# EasyEDA Pro project Complete_project.epro, board PCB2
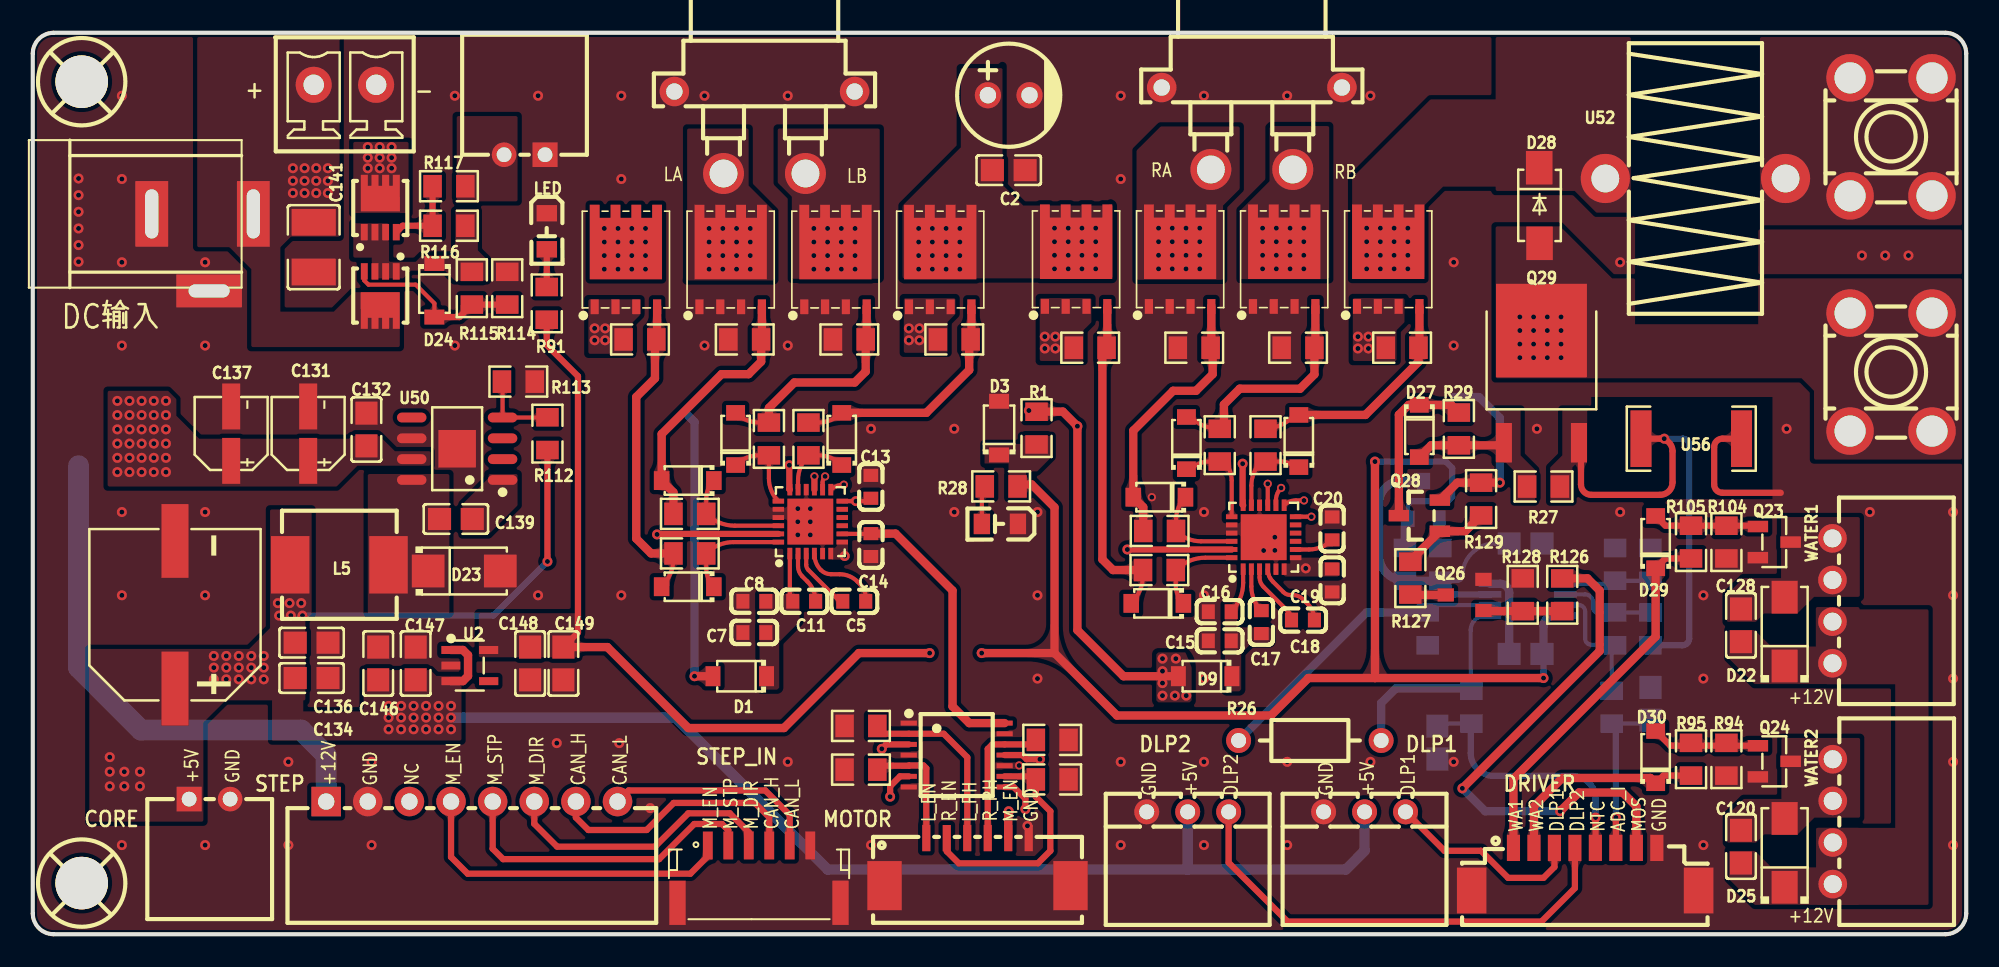
[diagram p14: board, top side]
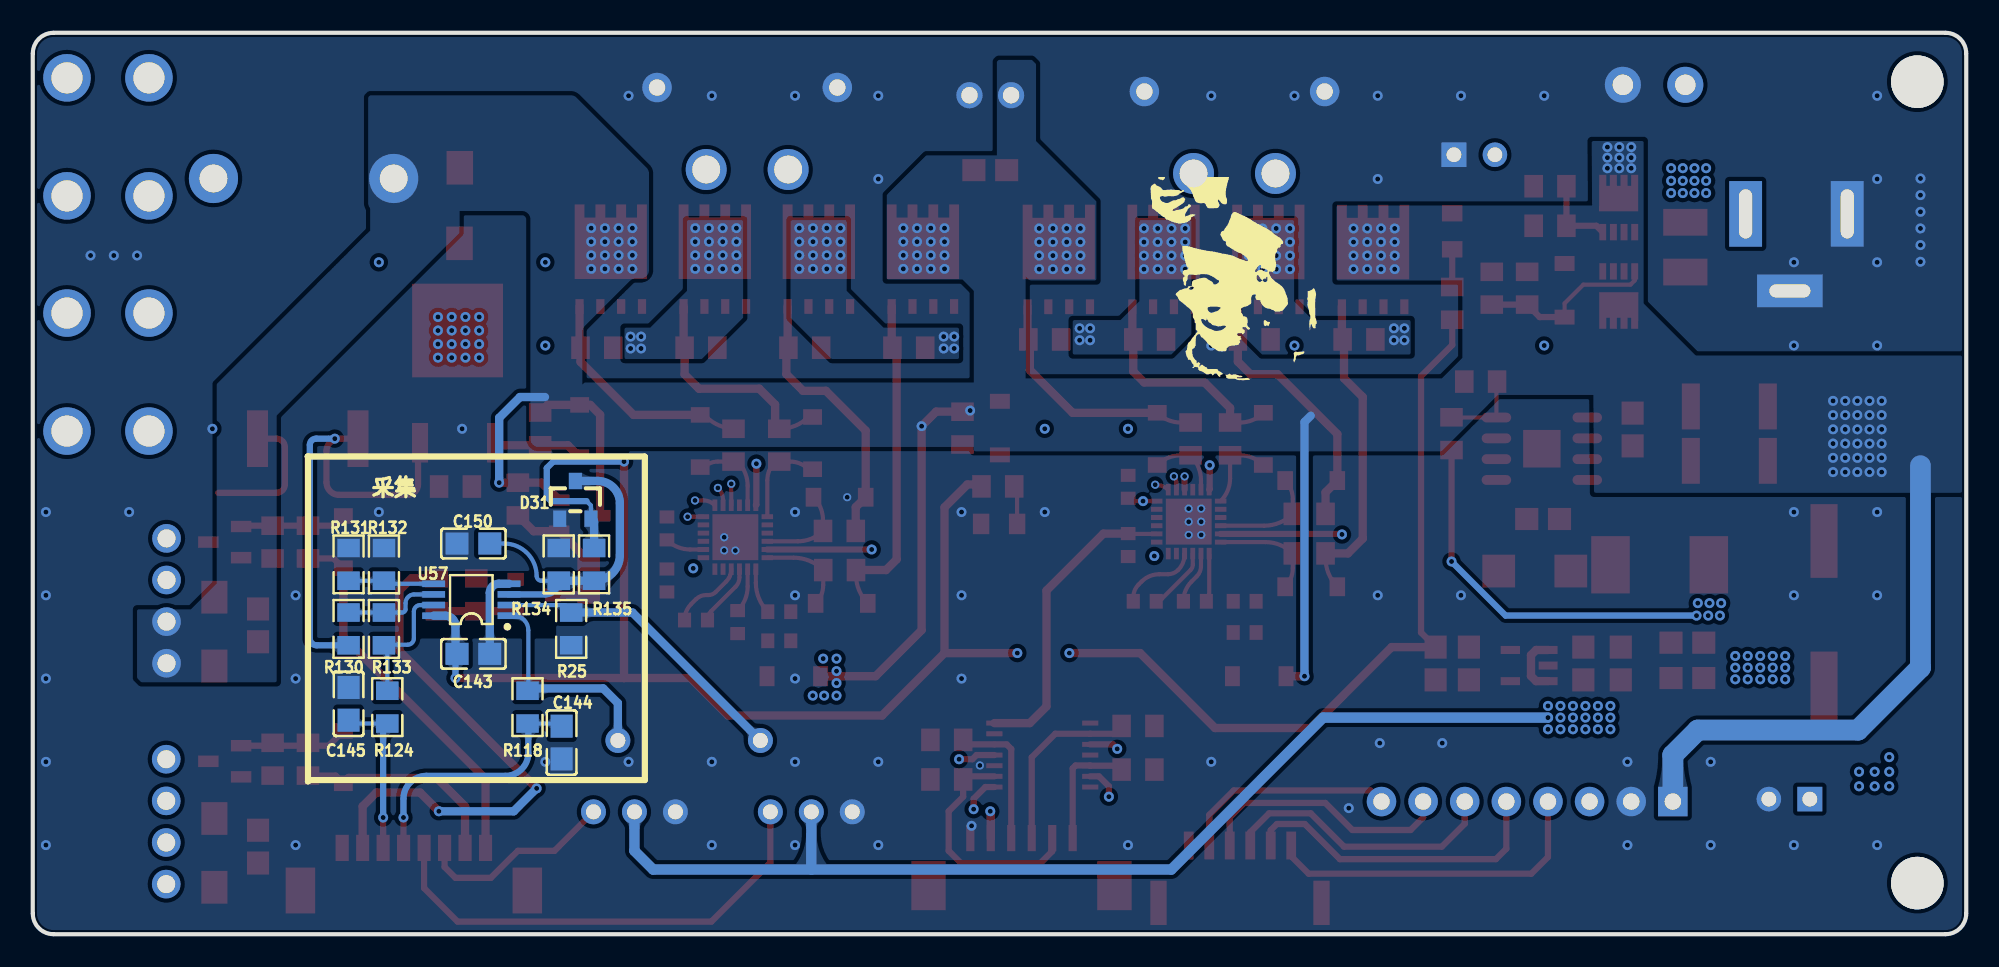
[diagram p15: board, bottom side, seen from below]

Outline 118 x 55 mm; copper layers: Top Layer, 信号层, GND, Bottom Layer. Coordinates in mm from the lower left corner of the outline.
Outline path: 0,53.73 0,1.27 arc(0.37,0.37) 1.27,0 116.73,0 arc(117.63,0.37) 118,1.27 118,53.73 arc(117.63,54.63) 116.73,55 1.27,55 arc(0.37,54.63) 0,53.73
Stack: Top Layer 0.035mm 外层铜厚1oz / Dielectric1 0.2104mm 7628 RC49% 8.6mil / 信号层 0.035mm / Dielectric2 1.065mm 1.1mm H/HOZ Copper / GND 0.035mm / Dielectric3 0.2104mm 7628 RC49% 8.6mil / Bottom Layer 0.035mm 外层铜厚1oz

## Design rules (mm)
template: 自定义配置
spacing copperThickness1oz (default): track to track 0.102, other pairs 0.152 to 0.3
spacing copperThickness2oz: track to track 0.203, other pairs 0.152 to 0.3
track width copperThickness1oz (default): min 0.127, default 0.254, max 2.54
track width copperThickness2oz: min 0.203, default 0.254, max 2.54
differential pair differentialPair (default): width min 0.127, default 0.254, max 2.54; gap min 0.152, default 0.152
via viaSize (default): diameter min 0.5, default 0.61, max 10; hole min 0.3, default 0.305, max 6.3

## Placement (name value [footprint] x y rotation side)
C1  220uF  [CAP-TH_BD6.3-P2.50-D1.0-FD]  59.56 51.19 0 top
C2  100nF  [C0805]  59.56 46.62 180 top
C5  100nF  [C0603]  50.13 20.31 180 top
C7  10uF  [C0603]  44.04 18.41 0 top
C8  100nF  [C0603]  44.04 20.31 0 top
C11  1uF  [C0603]  47.08 20.31 180 top
C13  1uF  [C0603]  51.15 27.3 90 top
C14  1uF  [C0603]  51.15 23.74 270 top
C15  10uF  [C0603]  72.44 17.9 0 top
C16  100nF  [C0603]  72.44 19.68 0 top
C17  1uF  [C0603]  74.98 19.04 270 top
C18  100nF  [C0603]  77.52 19.17 180 top
C19  1uF  [C0603]  79.3 21.58 270 top
C20  1uF  [C0603]  79.3 24.76 90 top
C120  100nF  [C0805]  104.25 5.34 270 top
C128  100nF  [C0805]  104.25 18.85 270 top
C131  4.7uF  [CAP-SMD_BD4.0-L4.3-W4.3-LS5.0-FD]  16.81 30.54 90 top
C132  100nF  [C0805]  20.36 30.8 270 top
C134  100nF  [C0805]  17.02 15.63 180 top
C135  470uF  [CAP-SMD_BD10.0-L10.3-W10.3-LS11.3-FD]  8.68 19.49 90 top
C136  100nF  [C0805]  17.02 17.79 180 top
C137  4.7uF  [CAP-SMD_BD4.0-L4.3-W4.3-LS5.0-FD]  12.11 30.54 90 top
C139  100nF  [C0805]  25.82 25.33 180 top
C141  100nF  [C1210]  17.14 41.92 270 top
C143  100nF  [C0805]  91.11 17.11 0 bottom
C144  10nF  [C0805]  85.72 11.69 90 bottom
C145  10nF  [C0805]  98.73 14.06 270 bottom
C146  100nF  [C0805]  21.08 16.52 270 top
C147  100nF  [C0805]  23.37 16.52 270 top
C148  100nF  [C0805]  30.35 16.52 90 top
C149  100nF  [C0805]  32.39 16.52 90 top
C150  100nF  [C0805]  91.11 23.84 0 bottom
CN16  ZX-XH2.54-2PWZ  [CONN-TH_2P-P2.50_ZX-XH2.54-2PWZ]  30.01 47.56 180 top
CN111  WJ15EDGVC-3.81-2P  [CONN-TH_WJ15EDGVC-3.81-2P]  19.05 51.82 0 top
CORE  -  [CONN-TH_2P-P2.50_ZX-XH2.54-2PWZ]  10.8 8.24 0 top
D1  1N5819W_C963381  [SOD-123_L2.7-W1.6-LS3.7-RD]  43.15 15.74 180 top
D2  1N4148W-E  [SOD-123_L2.8-W1.6-LS3.7-RD]  39.97 21.2 180 top
D3  BZT52C3V3  [SOD-123_L2.7-W1.6-LS3.7-RD]  58.97 30.88 90 top
D5  1N4148W-E  [SOD-123_L2.8-W1.6-LS3.7-RD]  39.97 27.68 180 top
D6  1N4148W-E  [SOD-123_L2.8-W1.6-LS3.7-RD]  49.37 30.22 90 top
D7  1N4148W-E  [SOD-123_L2.8-W1.6-LS3.7-RD]  42.9 30.22 90 top
D8  1N4148W-E  [SOD-123_L2.8-W1.6-LS3.7-RD]  68.63 20.19 180 top
D9  1N5819W_C963381  [SOD-123_L2.7-W1.6-LS3.7-RD]  71.55 15.74 180 top
D10  1N4148W-E  [SOD-123_L2.8-W1.6-LS3.7-RD]  68.76 26.66 180 top
D11  1N4148W-E  [SOD-123_L2.8-W1.6-LS3.7-RD]  77.27 30.09 90 top
D12  1N4148W-E  [SOD-123_L2.8-W1.6-LS3.7-RD]  70.41 29.97 90 top
D22  SS34  [SMA_L4.3-W2.5-LS5.0-RD]  106.92 18.46 90 top
D23  SS56  [SMA_L4.3-W2.6-LS5.2-RD]  26.33 22.16 0 top
D24  BZT52C27  [SOD-123_L2.7-W1.6-LS3.7-RD]  24.51 39.29 270 top
D25  SS34  [SMA_L4.3-W2.5-LS5.0-RD]  106.92 4.96 90 top
D27  1N4148W-E  [SOD-123_L2.8-W1.6-LS3.7-RD]  84.62 30.7 270 top
D28  SS54  [SMA_L4.3-W2.6-LS5.0-FD]  91.95 44.46 90 top
D29  1N4148W-E  [SOD-123_L2.8-W1.6-LS3.7-RD]  99.04 23.93 90 top
D30  1N4148W-E  [SOD-123_L2.8-W1.6-LS3.7-RD]  99.04 10.8 90 top
D31  BAV99  [SOT-23_L2.9-W1.3-P1.90-LS2.4-BR]  84.88 26.5 270 bottom
DLP1  HC-5264-3AW  [CONN-TH_3P-P2.50_HCTL_HC-5264-3AW]  81.28 7.47 180 top
DLP2  HC-5264-3AW  [CONN-TH_3P-P2.50_HCTL_HC-5264-3AW]  70.49 7.47 180 top
DRIVER  1.25-8P WT  [CONN-SMD_8P-P1.25-L4.4-W14.8]  94.74 3.97 0 top
J1  -  [DC-005]  13.46 43.95 180 top
L5  10uH  [IND-SMD_L7.3-W6.8]  18.71 22.54 180 top
LED  -  [LED_0805]  31.37 42.84 270 top
LED1  -  [LED_0805]  58.97 25.04 180 top
MOTOR  1.25-6P WT  [CONN-SMD_1.25-6PWT]  57.66 4.41 180 top
Q1  CSD18540Q5B(TOKMAS)  [TDSON-8_L5.9-W5.2-P1.27-BL]  36.2 40.06 0 top
Q2  CSD18540Q5B(TOKMAS)  [TDSON-8_L5.9-W5.2-P1.27-BL]  42.59 40.06 0 top
Q3  CSD18540Q5B(TOKMAS)  [TDSON-8_L5.9-W5.2-P1.27-BL]  55.38 40.06 0 top
Q4  CSD18540Q5B(TOKMAS)  [TDSON-8_L5.9-W5.2-P1.27-BL]  48.99 40.06 0 top
Q5  CSD18540Q5B(TOKMAS)  [TDSON-8_L5.9-W5.2-P1.27-BL]  63.67 40.08 0 top
Q6  CSD18540Q5B(TOKMAS)  [TDSON-8_L5.9-W5.2-P1.27-BL]  70.02 40.08 0 top
Q7  CSD18540Q5B(TOKMAS)  [TDSON-8_L5.9-W5.2-P1.27-BL]  82.72 40.08 0 top
Q8  CSD18540Q5B(TOKMAS)  [TDSON-8_L5.9-W5.2-P1.27-BL]  76.37 40.08 0 top
Q21  AON7401-MS  [POWERDI3333-8_DMN7022LFGQ-7]  21.21 39.42 180 top
Q22  AON7401-MS  [POWERDI3333-8_DMN7022LFGQ-7]  21.21 43.86 0 top
Q23  -  [SOT-23-3_L2.9-W1.3-P1.90-LS2.4-BR]  106.28 23.93 180 top
Q24  -  [SOT-23-3_L2.9-W1.3-P1.90-LS2.4-BR]  106.28 10.55 180 top
Q26  -  [S8050_SOT-23]  87.39 20.57 0 top
Q28  -  [S8550P_SOT]  84.58 25.54 0 top
Q29  LR7843-VB  [TO-252-2_L6.6-W6.1-P4.58-LS9.9-BR]  92.07 33.41 270 top
R1  10K  [R0805]  61.26 30.88 270 top
R3  10K  [R0805]  50.55 12.71 0 top
R4  10K  [R0805]  50.55 10.04 0 top
R5  10K  [R0805]  62.22 11.86 180 top
R6  10K  [R0805]  62.22 9.44 180 top
R7  4.7  [R0805]  40.1 23.23 180 top
R8  4.7  [R0805]  40.1 25.65 180 top
R9  1K  [R0805]  37.06 36.29 0 top
R10  1K  [R0805]  43.45 36.29 0 top
R11  4.7  [R0805]  47.34 30.22 90 top
R12  1K  [R0805]  56.24 36.29 0 top
R13  4.7  [R0805]  44.93 30.22 90 top
R14  1K  [R0805]  49.83 36.29 0 top
R15  4.7  [R0805]  68.76 22.22 180 top
R16  4.7  [R0805]  68.77 24.6 180 top
R17  1K  [R0805]  64.53 35.79 0 top
R18  1K  [R0805]  70.88 35.79 0 top
R19  4.7  [R0805]  75.24 29.84 90 top
R20  1K  [R0805]  83.57 35.79 0 top
R21  4.7  [R0805]  72.44 29.84 90 top
R22  1K  [R0805]  77.22 35.79 0 top
R25  100  [R0805]  85.14 18.63 90 bottom
R26  MF58 104F3950  [RES-TH_BD2.5-L4.7-P8.70-D0.5]  77.94 11.82 0 top
R27  10K  [R0805]  92.2 27.31 180 top
R28  1K  [R0805]  59.1 27.32 0 top
R29  10  [R0805]  87.03 30.83 90 top
R91  10K  [R0805]  31.37 38.49 270 top
R94  1k  [R0805]  103.36 10.68 90 top
R95  20  [R0805]  101.2 10.68 90 top
R104  1k  [R0805]  103.36 23.93 90 top
R105  20  [R0805]  101.2 23.93 90 top
R112  6.8K  [R0805]  31.41 30.54 270 top
R113  2.2K  [R0805]  29.63 33.72 180 top
R114  10K  [R0805]  28.96 39.42 270 top
R115  10K  [R0805]  26.8 39.42 270 top
R116  100K  [R0805]  25.4 43.23 180 top
R117  100R  [R0805]  25.4 45.64 0 top
R118  1K  [R0805]  87.81 13.86 90 bottom
R124  1K  [R0805]  96.36 13.86 90 bottom
R126  1K  [R0805]  93.34 20.71 270 top
R127  1K  [R0805]  84.07 21.73 90 top
R128  10K  [R0805]  90.93 20.71 270 top
R129  10K  [R0805]  88.39 26.55 90 top
R130  1K  [R0805]  98.73 18.63 90 bottom
R131  1K  [R0805]  98.73 22.57 270 bottom
R132  100K  [R0805]  96.57 22.57 270 bottom
R133  100K  [R0805]  96.57 18.63 270 bottom
R134  1K  [R0805]  85.9 22.57 90 bottom
R135  10K  [R0805]  83.74 22.57 90 bottom
SCREW1  -  [M3螺丝]  3.05 3.06 0 top
SCREW2  -  [M3螺丝]  3.05 51.95 0 top
STEP  XH-8AW  [CONN-TH_8P-P2.54_HCTL_XH-8AW_C2908617]  26.8 8.09 0 top
STEP_IN  -  [CONN-TH_SM06B-GHS-TB-LF-SN]  44.32 3.67 0 top
U1  DRV8701ERGER  [VQFN-24_L4.0-W4.0-P0.50-BL-EP2.8]  47.45 25.17 0 top
U2  RT9013-33GB  [SOT-23-5_L3.0-W1.7-P0.95-LS2.8-BL]  26.67 16.39 270 top
U3  XT30PW-F20.G.Y  [CONN-TH_XT30PW-F-1]  74.4 49.16 180 top
U4  XT30PW-F20.G.Y  [CONN-TH_XT30PW-F-1]  44.66 48.91 180 top
U5  SN74HC125PWR  [TSSOP-14_L5.0-W4.4-P0.65-LS6.5-BL]  56.39 10.93 270 top
U6  DRV8701ERGER  [VQFN-24_L4.0-W4.0-P0.50-BL-EP2.8]  75.12 24.22 0 top
U50  TPS5450DDAR  [SOP-8_L4.9-W3.9-P1.27-LS6.0-BL-EP]  25.9 29.62 90 top
U52  47uH  [IND-TH_L16.5-W8.5-P11.00-D1.0]  101.47 46.11 0 top
U53  T44001  [CONN-TH_T44001]  113.41 48.65 0 top
U54  T44001  [CONN-TH_T44001]  113.41 34.3 0 top
U56  3mΩ  [R2512]  101.22 30.23 180 top
U57  SGM8632CXMS8G/TR  [MSOP-8_L3.0-W3.0-P0.65-LS4.9-BL]  91.23 20.41 90 bottom
WATER1  XH-4AW  [CONN-TH_XH-4AW]  109.84 20.34 90 top
WATER2  XH-4AW  [CONN-TH_XH-4AW]  109.85 6.87 90 top

## Footprints (pads in the part's own frame, mm; a bottom-side part is the same pattern mirrored in y, then rotated)
C0603
  rect 0.8x0.9 smd: 1(-0.7,0) 2(0.7,0)
C0805
  rect 1.41x1.35 smd: 1(-1,0) 2(1,0)
C1210
  rect 1.635x2.7 smd: 1(-1.518,0) 2(1.518,0)
CAP-SMD_BD4.0-L4.3-W4.3-LS5.0-FD
  rect 2.8x1.1 smd: 1(-1.661,0) 2(1.661,0)
CAP-SMD_BD10.0-L10.3-W10.3-LS11.3-FD
  rect 4.5x1.65 smd: 1(-4.5,0) 2(4.5,0)
CAP-TH_BD6.3-P2.50-D1.0-FD
  round 1.6 hole 1: 1(-1.27,0) 2(1.27,0)
CONN-SMD_1.25-6PWT
  rect 0.5x1.6 smd: 1(3.125,-1.45) 2(1.875,-1.45) 3(0.625,-1.45) 4(-0.625,-1.45) 5(-1.875,-1.45) 6(-3.125,-1.45)
  rect 2.1x3 smd: 7(-5.675,1.45) 8(5.675,1.45)
CONN-SMD_8P-P1.25-L4.4-W14.8
  rect 1.8x2.8 smd: 0(-6.925,-1.3) 0(6.925,-1.3)
  rect 0.8x1.6 smd: 1(-4.375,1.3) 2(-3.125,1.3) 3(-1.875,1.3) 4(-0.625,1.3) 5(0.625,1.3) 6(1.875,1.3) 7(3.125,1.3) 8(4.375,1.3)
CONN-TH_2P-P2.50_ZX-XH2.54-2PWZ
  rect 1.524x1.5 hole 0.9: 1(-1.25,0)
  round 1.5 hole 0.9: 2(1.25,0)
CONN-TH_3P-P2.50_HCTL_HC-5264-3AW
  round 1.524 hole 0.914: 1(-2.5,0) 2(0,0) 3(2.5,0)
CONN-TH_8P-P2.54_HCTL_XH-8AW_C2908617
  rect 1.8x1.8 hole 1: 1(-8.89,0)
  round 1.8 hole 1: 2(-6.35,0) 3(-3.81,0) 4(-1.27,0) 5(1.27,0) 6(3.81,0) 7(6.35,0) 8(8.89,0)
CONN-TH_SM06B-GHS-TB-LF-SN
  rect 0.6x1.7 smd: 1(-3.126,1.75) 2(-1.875,1.75) 3(-0.625,1.75) 4(0.625,1.75) 5(1.875,1.75) 6(3.124,1.75)
  rect 1x2.7 smd: 7(-4.974,-1.749) 8(4.974,-1.75)
CONN-TH_T44001
  round 2.9 hole 1.9: 1(-2.5,3.6) 2(-2.5,-3.6) 3(2.5,-3.6) 4(2.5,3.6)
CONN-TH_WJ15EDGVC-3.81-2P
  round 2.2 hole 1.25: 1(-1.905,0) 2(1.905,0)
CONN-TH_XH-4AW
  round 1.75 hole 1.1: 1(-3.81,0) 2(-1.27,0) 3(1.27,0) 4(3.81,0)
CONN-TH_XT30PW-F-1
  round 2.5 hole 1.7: 1(-2.5,2.5) 2(2.5,2.5)
  round 1.8 hole 1: 3(5.5,-2.5) 4(-5.5,-2.5)
DC-005
  rect 2x4 hole 0.8x3: 1(0,0) 2(6.2,0)
  rect 4x2 hole 2.5x0.8: 3(2.7,4.7)
IND-SMD_L7.3-W6.8
  rect 2.35x3.5 smd: 1(-3,0) 2(3,0)
IND-TH_L16.5-W8.5-P11.00-D1.0
  round 3 hole 1.7: 1(-5.5,0) 2(5.5,0)
LED_0805
  rect 1x1.25 smd: 1(-1.15,0.005) 2(1.05,0.005)
M3螺丝
  round 3.2 hole 3.2: 1(-0.064,0.064)
MSOP-8_L3.0-W3.0-P0.65-LS4.9-BL
  rect 0.406x1.397 smd: 1(-0.975,-2.3) 2(-0.325,-2.3) 3(0.325,-2.3) 4(0.975,-2.3) 5(0.975,2.3) 6(0.325,2.3) 7(-0.325,2.3) 8(-0.975,2.3)
POWERDI3333-8_DMN7022LFGQ-7
  rect 0.42x1 smd: 1(-0.975,-1.025) 2(-0.325,-1.025) 3(0.325,-1.025) 4(0.975,-1.025)
  custom 0x0 smd: 5(0.005,1.025)
R0805
  rect 1.133x1.377 smd: 1(-1,0) 2(1,0)
R2512
  rect 1.282x3.456 smd: 1(-3.067,0) 2(3.067,0)
RES-TH_BD2.5-L4.7-P8.70-D0.5
  round 1.524 hole 0.914: 1(-4.35,0) 2(4.35,0)
S8050_SOT-23
  rect 1x0.8 smd: 1(1.15,-0.823) 2(1.15,1.077) 3(-1.15,0.127)
S8550P_SOT
  rect 1.25x0.701 smd: 1(1.292,-0.95) 2(1.292,0.95) 3(-1.208,0)
SMA_L4.3-W2.5-LS5.0-RD
  rect 2x1.593 smd: 1(-2.1,0) 2(2.1,0)
SMA_L4.3-W2.6-LS5.0-FD
  rect 2.046x1.62 smd: 1(-2.304,-0.009) 2(2.304,0.009)
SMA_L4.3-W2.6-LS5.2-RD
  rect 2x2 smd: 1(-2.2,0) 2(2.2,0)
SOD-123_L2.7-W1.6-LS3.7-RD
  rect 0.91x1.22 smd: 1(-1.635,0) 2(1.635,0)
SOD-123_L2.8-W1.6-LS3.7-RD
  rect 0.95x1.15 smd: 1(-1.593,0) 2(1.593,0)
SOP-8_L4.9-W3.9-P1.27-LS6.0-BL-EP
  oval 0.6x1.8 smd: 1(-1.905,-2.772) 2(-0.635,-2.772) 3(0.635,-2.772) 4(1.905,-2.772) 5(1.905,2.772) 6(0.635,2.772) 7(-0.635,2.772) 8(-1.905,2.772)
  rect 2.29x2.29 smd: 9(0,0)
SOT-23-3_L2.9-W1.3-P1.90-LS2.4-BR
  rect 1.25x0.7 smd: 1(1,-0.95) 2(1,0.95) 3(-1,0)
SOT-23-5_L3.0-W1.7-P0.95-LS2.8-BL
  rect 0.49x1.157 smd: 1(-0.95,-1.153) 2(0,-1.153) 3(0.95,-1.153)
  rect 0.49x1.175 smd: 4(0.95,1.153) 5(-0.95,1.153)
SOT-23_L2.9-W1.3-P1.90-LS2.4-BR
  rect 1x0.8 smd: 1(1.15,-0.95) 2(1.15,0.95) 3(-1.15,0)
TDSON-8_L5.9-W5.2-P1.27-BL
  rect 0.5x0.9 smd: 1(-1.905,-1.775) 2(-0.635,-1.775) 3(0.635,-1.775) 4(1.905,-1.775)
  custom 0x0 smd: 5(0,1.775)
TO-252-2_L6.6-W6.1-P4.58-LS9.9-BR
  rect 2.409x0.979 smd: 1(3.424,-2.29) 3(3.424,2.29)
  rect 5.711x5.548 smd: 2(-3.424,0)
TSSOP-14_L5.0-W4.4-P0.65-LS6.5-BL
  rect 0.305x0.991 smd: 1(-1.95,-2.925) 2(-1.3,-2.925) 3(-0.65,-2.925) 4(0,-2.925) 5(0.65,-2.925) 6(1.3,-2.925) 7(1.95,-2.925) 8(1.95,2.925) 9(1.3,2.925) 10(0.65,2.925) 11(0,2.925) 12(-0.65,2.925) 13(-1.3,2.925) 14(-1.95,2.925)
VQFN-24_L4.0-W4.0-P0.50-BL-EP2.8
  rect 0.3x0.7 smd: 1(-1.25,-1.95) 2(-0.75,-1.95) 3(-0.25,-1.95) 4(0.25,-1.95) 5(0.75,-1.95) 6(1.25,-1.95) 13(1.25,1.95) 14(0.75,1.95) 15(0.25,1.95) 16(-0.25,1.95) 17(-0.75,1.95) 18(-1.25,1.95)
  rect 0.7x0.3 smd: 7(1.95,-1.25) 8(1.95,-0.75) 9(1.95,-0.25) 10(1.95,0.25) 11(1.95,0.75) 12(1.95,1.25) 19(-1.95,1.25) 20(-1.95,0.75) 21(-1.95,0.25) 22(-1.95,-0.25) 23(-1.95,-0.75) 24(-1.95,-1.25)
  rect 2.8x2.8 smd: 25(0,0)

## Nets
As in the schematic, except:
+5V: C134.2 C135.1 C136.2 C146.2 C147.2 CORE.1 DLP1.2 DLP2.2 L5.2 R112.2 U2.1 U2.3
GND: C1.2 C2.1 C7.1 C8.1 C13.2 C14.2 C15.1 C16.1 C19.2 C20.2 C131.2 C132.1 C134.1 C135.2 C136.1 C137.2 C141.2 C143.1 C144.1 C145.1 C146.1 C147.1 C148.1 C149.1 C150.2 CN16.1 CN111.2 CORE.2 D3.2 D23.2 D31.1 DLP1.3 DLP2.3 DRIVER.0 DRIVER.8 J1.2 J1.3 LED.1 LED1.1 MOTOR.6 MOTOR.7 MOTOR.8 Q2.1 Q2.2 Q2.3 Q4.1 Q4.2 Q4.3 Q6.1 Q6.2 Q6.3 Q8.1 Q8.2 Q8.3 Q23.2 Q24.2 Q26.2 R3.1 R4.1 R5.1 R6.1 R10.1 R14.1 R18.1 R22.1 R25.1 R94.1 R104.1 R113.1 R114.1 R128.1 R131.1 R132.1 R134.2 STEP.2 STEP_IN.6 STEP_IN.7 STEP_IN.8 U1.5 U1.16 U1.20 U1.21 U1.25 U2.2 U3.3 U3.4 U4.3 U4.4 U5.1 U5.4 U5.7 U5.10 U5.13 U6.5 U6.16 U6.20 U6.21 U6.25 U50.6 U50.9 U56.1 U57.4
CAN_H: STEP.7 STEP_IN.4
CAN_L: STEP.8 STEP_IN.5
INPUT: C141.1 CN111.1 J1.1 Q21.5
M_DIR: STEP.6 STEP_IN.3
M_EN: STEP.4 STEP_IN.1
M_STP: STEP.5 STEP_IN.2
$3N810: LED.2 R91.1

Pads without a net: SCREW1 1; SCREW2 1; STEP 3; U1 9 10 11; U2 4; U6 9 10 11; U50 2 3 5

## Via types
v1: diameter 0.5, hole 0.299, Top Layer to Bottom Layer, 18 vias
v2: diameter 0.61, hole 0.305, Top Layer to Bottom Layer, 369 vias

## Routing (per net, layer and track width the routed paths; a pad name or vN(x,y) marks a point on that pad's centre or on a via; arc(x,y) is an arc through that point)
+0.3V: length 20.3
  Bottom Layer w0.254: R134.1 86.96,21.57 arc(87.17,21.65) 87.25,21.85 arc(87.83,23.26) 89.23,23.84 C150.1
  Bottom Layer w0.381: U57.3 86.73,20.73 arc(86.14,20.98) R134.1
  Bottom Layer w0.508: D31.3 83.53,27.65 arc(82.57,27.26) 82.17,26.3 82.17,23.14 arc(82.63,22.03) R135.1 R134.1
+3.3V: length 129.6
  Top Layer w0.381: R91.2 31.37,35.95 33.27,34.04 33.27,18.41 C149.2
  Top Layer w0.508: v2(81.91,28.84) 81.91,15.63 ; 81.91,15.63 v2(92.2,15.63) ; 81.91,15.63 77.85,15.63 75.56,13.34 66.17,13.34 62.36,17.15 ; v2(57.91,17.15) 62.36,17.15 ; 62.36,17.15 62.36,26.04 60.96,27.44 60.22,27.44 R28.2 ; C149.2 35.07,17.52 40,12.58 45.85,12.58 50.42,17.15 v2(54.74,17.15)
  信号层 w0.508: v2(54.74,17.15) v2(57.91,17.15)
  Bottom Layer w0.254: 84.2,26.42 83.93,26.16 83.93,25.35
  Bottom Layer w0.381: 84.2,26.42 86.36,26.42 86.63,26.69 86.63,28.44 86.23,28.84 v2(81.91,28.84) ; C143.2 92.2,17.01 v2(92.2,15.63)
  Bottom Layer w0.508: 93.53,19.43 92.83,19.43 arc(92.39,19.25) 92.2,18.8 92.2,17.2 arc(92.17,17.13) C143.2 ; R135.2 83.74,25.16 arc(83.8,25.3) 83.93,25.35
+5V: length 92.7
  Top Layer w0.381: R112.2 v2(31.41,22.74)
  Top Layer w0.508: U2.3 26.25,15.44 26.56,15.76 26.56,17.03 26.25,17.34 U2.1
  Bottom Layer w0.381: v2(16.46,19.44) 28.11,19.44 v2(31.41,22.74)
  Bottom Layer w0.635: 70.49,3.95 DLP2.2 ; DLP1.2 81.28,5.09 80.14,3.95 48.51,3.95 39.24,13.22 v2(25.53,13.22)
  vias: v2(4.7,10.8) v2(4.7,9.91) v2(4.7,9.03) v2(5.59,9.91) v2(5.59,9.03) v2(6.54,9.91) v2(6.54,9.03) v2(11.05,16.98) v2(11.05,16.27) v2(11.05,15.55) v2(11.81,16.98) v2(11.81,16.27) v2(11.81,15.55) v2(12.57,16.98) v2(12.57,16.27) v2(12.57,15.55) v2(13.34,16.98) v2(13.34,16.27) v2(13.34,15.55) v2(14.1,16.98) v2(14.1,16.27) v2(14.1,15.55) v2(14.96,20.2) v2(15.03,19.44) v2(15.67,20.2) v2(15.75,19.44) v2(16.38,20.2) v2(21.72,13.93) v2(21.72,13.22) v2(21.72,12.5) v2(22.48,13.93) v2(22.48,13.22) v2(22.48,12.5) v2(23.24,13.93) v2(23.24,13.22) v2(23.24,12.5) v2(24,13.93) v2(24,13.22) v2(24,12.5) v2(24.77,13.93) v2(24.77,13.22) v2(24.77,12.5) v2(25.53,13.93) v2(25.53,12.5)
+12V: length 83.7
  Top Layer w0.508: D1.2 v2(40.39,15.74) ; R1.1 61.27,31.89 62.87,31.89 v2(63.75,31) 63.75,18.55 66.56,15.74 D9.2 ; 85.87,26.49 86.94,27.55 R129.2 v2(89.53,27.55)
  Bottom Layer w0.508: 40,31.63 40.39,31.25 v2(40.39,15.74) ; 86.74,32.77 88.27,32.77 89.53,31.5 v2(89.53,27.55)
  Bottom Layer w1.27: 2.79,28.58 2.79,16.27 6.6,12.45 16.38,12.45 17.91,10.93 STEP.1
  vias: v2(5.16,32.54) v2(5.16,31.67) v2(5.16,30.8) v2(5.16,29.93) v2(5.16,29.07) v2(5.16,28.2) v2(5.9,32.54) v2(5.9,31.67) v2(5.9,30.8) v2(5.9,29.93) v2(5.9,29.07) v2(5.9,28.2) v2(6.64,32.54) v2(6.64,31.67) v2(6.64,30.8) v2(6.64,29.93) v2(6.64,29.07) v2(6.64,28.2) v2(7.39,32.54) v2(7.39,31.67) v2(7.39,30.8) v2(7.39,29.93) v2(7.39,29.07) v2(7.39,28.2) v2(8.13,32.54) v2(8.13,31.67) v2(8.13,30.8) v2(8.13,29.93) v2(8.13,29.07) v2(8.13,28.2) v2(20.45,48.03) v2(20.45,47.38) v2(20.45,46.73) v2(21.17,48.03) v2(21.17,47.38) v2(21.17,46.73) v2(21.9,48.03) v2(21.9,47.38) v2(21.9,46.73) v2(34.88,43.06) v2(34.88,42.23) v2(34.88,41.41) v2(34.88,40.58) v2(35.72,43.06) v2(35.72,42.23) v2(35.72,41.41) v2(35.72,40.58) v2(36.56,43.06) v2(36.56,42.23) v2(36.56,41.41) v2(36.56,40.58) v2(37.39,43.06) v2(37.39,42.23) v2(37.39,41.41) v2(37.39,40.58) v2(54.06,43.06) v2(54.06,42.23) v2(54.06,41.41) v2(54.06,40.58) v2(54.9,43.06) v2(54.9,42.23) v2(54.9,41.41) v2(54.9,40.58) v2(55.74,43.06) v2(55.74,42.23) v2(55.74,41.41) v2(55.74,40.58) v2(56.58,43.06) v2(56.58,42.23) v2(56.58,41.41) v2(56.58,40.58) v2(60.79,31.95) v2(62.36,43.08) v2(62.36,42.25) v2(62.36,41.42) v2(62.36,40.6) v2(63.19,43.08) v2(63.19,42.25) v2(63.19,41.42) v2(63.19,40.6) v2(64.03,43.08) v2(64.03,42.25) v2(64.03,41.42) v2(64.03,40.6) v2(64.87,43.08) v2(64.87,42.25) v2(64.87,41.42) v2(64.87,40.6) v2(68.95,16.81) v2(68.95,16.05) v2(68.95,15.32) v2(68.95,14.56) v2(69.76,16.81) v2(69.7,14.56) v2(70.4,14.56) v2(81.41,43.08) v2(81.41,42.25) v2(81.41,41.42) v2(81.41,40.6) v2(82.24,43.08) v2(82.24,42.25) v2(82.24,41.42) v2(82.24,40.6) v2(83.08,43.08) v2(83.08,42.25) v2(83.08,41.42) v2(83.08,40.6) v2(83.92,43.08) v2(83.92,42.25) v2(83.92,41.42) v2(83.92,40.6)
DVDD: length 18.8
  Top Layer w0.254: U1.8 51.11,24.43 arc(51.13,24.43) C14.1
  Top Layer w0.508: C14.1 52.66,24.44 56.13,20.96 56.13,13.9 57.15,12.88 U5.14
GND: length 13.8
  Top Layer w0.381: 106.68,26.93 103.12,26.93 arc(102.76,27.08) 102.62,27.44 102.62,29.73 arc(102.76,30.09) 103.12,30.23 U56.1
  Bottom Layer w0.508: C143.1 90.11,20.84 arc(89.95,21.22) 89.56,21.38 U57.4
  vias: v1(46.69,25.97) v1(46.69,25.17) v1(46.69,24.36) v1(47.45,25.97) v1(47.45,25.17) v1(47.45,24.36) v1(60.2,10.3) v1(68.3,26.66) v1(75.12,23.41) v1(75.8,24.22) v1(75.81,23.42) v2(2.79,46.11) v2(2.79,45.09) v2(2.79,44.08) v2(2.79,43.06) v2(2.79,42.05) v2(2.79,41.03) v2(5.44,51.16) v2(5.44,46.08) v2(5.44,41) v2(5.44,35.92) v2(5.44,25.76) v2(5.44,20.68) v2(5.44,5.44) v2(10.52,41) v2(10.52,35.92) v2(10.52,25.76) v2(10.52,20.68) v2(10.52,5.44) v2(15.6,10.52) v2(15.6,5.44) v2(20.68,10.52) v2(20.68,5.44) v2(25.76,51.16) v2(25.76,35.92) v2(30.84,51.16) v2(30.84,20.68) v2(31.98,11.66) v2(35.79,11.66) v2(35.92,51.16) v2(35.92,46.08) v2(35.92,20.68) v2(37.68,7.69) v2(41,51.16) v2(41,35.92) v2(46.08,51.16) v2(46.08,35.92) v2(46.08,10.52) v2(51.16,30.84) v2(51.16,5.44) v2(56.24,30.84) v2(56.24,25.76) v2(60.71,6.61) v2(61.32,25.76) v2(61.32,20.68) v2(61.32,15.6) v2(66.4,51.16) v2(66.4,46.08) v2(66.4,10.52) v2(66.4,5.44) v2(71.48,51.16) v2(71.48,25.76) v2(71.48,20.68) v2(71.48,15.6) v2(71.48,10.52) v2(71.48,5.44) v2(76.56,51.16) v2(76.56,10.52) v2(76.56,5.44) v2(81.64,51.16) v2(81.64,10.52) v2(86.72,41) v2(86.72,35.92) v2(86.72,10.52) v2(91.8,30.84) v2(96.88,41) v2(96.88,25.76) v2(101.96,20.68) v2(101.96,15.6) v2(101.96,5.44) v2(107.04,30.84) v2(111.63,41.41) v2(112.12,25.76) v2(113.05,41.41) v2(114.47,41.41) v2(117.2,25.76) v2(117.2,20.68) v2(117.2,15.6) v2(117.2,10.52) v2(117.2,5.44)
ADC_I: length 10.2
  Top Layer w0.381: DRIVER.6 v2(96.62,7.12)
  Bottom Layer w0.254: R124.1 98.53,12.86 arc(98.67,12.91) C145.2
  Bottom Layer w0.381: v2(96.62,7.12) 96.62,12.6 arc(96.54,12.78) R124.1
ADC_NTC: length 16.3
  Top Layer w0.381: v2(95.38,7.12) 95.38,5.28 arc(95.37,5.27) DRIVER.5
  Bottom Layer w0.254: R118.1 85.85,12.86 arc(85.71,12.91) 85.65,13.06
  Bottom Layer w0.381: v2(95.38,7.12) 95.38,8.26 arc(94.97,9.25) 93.98,9.66 89.15,9.66 arc(88.17,10.07) 87.76,11.06 87.76,12.81 arc(87.77,12.84) R118.1
CAN_H: length 15.9
  Top Layer w0.381: STEP_IN.4 44.95,7.13 44.07,8.01 39.12,8.01 37.47,6.36 33.91,6.36 33.15,7.12 STEP.7
CAN_L: length 13.3
  Top Layer w0.381: STEP_IN.5 46.2,7.28 44.7,8.77 36.36,8.77 STEP.8
DLP1: length 12.2
  Top Layer w0.381: DLP1.1 86.16,5.09 88.39,5.09 90.04,3.44 92.2,3.44 92.87,4.1 DRIVER.3
DLP2: length 29
  Top Layer w0.381: DLP2.1 72.99,4.37 76.58,0.77 92.07,0.77 94.12,2.81 DRIVER.4
I1: length 29.4
  Top Layer w0.381: U56.2 99.31,30.23 arc(99.53,30.2) 99.74,30.11 arc(99.99,29.83) 100.08,29.47 100.08,27.57 arc(99.85,27.03) 99.31,26.81 95.12,26.81 arc(94.67,26.99) 94.49,27.44 94.49,29.86 arc(94.45,29.95) Q29.3
  Bottom Layer w0.381: R130.1 100.68,17.63 arc(100.97,17.75) 101.09,18.04 101.09,29.85 arc(100.98,30.12) 100.71,30.23 v2(99.57,30.23)
INPUT:
  vias: v2(15.88,46.74) v2(15.88,45.97) v2(15.88,45.22) v2(16.59,46.74) v2(16.59,45.97) v2(16.59,45.22) v2(17.3,46.74) v2(17.3,45.97) v2(17.3,45.22) v2(18.01,46.74) v2(18.01,45.97) v2(18.01,45.22)
L_EN_IN: length 7.4
  Top Layer w0.381: R4.2 51.78,10.28 U5.5 53.48,10.3 54.36,10.3 54.53,10.12 54.53,5.9
L_PH: length 23.1
  Top Layer w0.381: U1.15 v1(47.7,27.93) ; v2(51.82,11.31) 52.09,11.58 U5.3
  信号层 w0.381: v1(47.7,27.93) 47.1,27.93 45.47,26.3 45.47,17.66 v2(51.82,11.31)
L_PH_IN: length 10.5
  Top Layer w0.381: 52.02,12.23 U5.2 55.6,12.23 57.03,10.79 57.03,5.9
L_PWM: length 24.4
  Top Layer w0.254: U1.14 48.2,27.57 arc(48.24,27.76) v1(48.36,27.93)
  Top Layer w0.381: v2(52.32,8.39) 52.32,9.03 52.93,9.63 U5.6
  信号层 w0.381: v2(52.32,8.39) 52.71,8.77 52.71,13.72 48.36,18.07 v1(48.36,27.93)
LA: length 20.6
  Top Layer w0.381: U1.23 38.13,24.43 v2(38.1,24.39)
  信号层 w0.381: v2(34.93,36.24) 34.93,27.56 v2(38.1,24.39)
  vias: v2(34.29,36.97) v2(34.29,36.24) v2(34.93,36.97) v2(41.28,43.06) v2(41.28,42.23) v2(41.28,41.41) v2(41.28,40.58) v2(42.11,43.06) v2(42.11,42.23) v2(42.11,41.41) v2(42.11,40.58) v2(42.95,43.06) v2(42.95,42.23) v2(42.95,41.41) v2(42.95,40.58) v2(43.79,43.06) v2(43.79,42.23) v2(43.79,41.41) v2(43.79,40.58)
LB: length 13.7
  Top Layer w0.381: v2(46.17,28.61) 46.17,27.16 U1.18
  信号层 w0.381: v2(46.17,28.61) 46.17,31.2 48.26,33.28 50.93,33.28 53.47,35.83 v2(53.47,36.24)
  vias: v2(47.67,43.06) v2(47.67,42.23) v2(47.67,41.41) v2(47.67,40.58) v2(48.51,43.06) v2(48.51,42.23) v2(48.51,41.41) v2(48.51,40.58) v2(49.35,43.06) v2(49.35,42.23) v2(49.35,41.41) v2(49.35,40.58) v2(50.18,43.06) v2(50.18,42.23) v2(50.18,41.41) v2(50.18,40.58) v2(53.47,36.97) v2(54.11,36.97) v2(54.11,36.24)
M_DIR: length 17.1
  Top Layer w0.381: STEP_IN.3 43.7,6.22 42.54,7.38 40,7.38 37.97,5.34 32,5.34 30.61,6.74 STEP.6
M_EN: length 20.6
  Top Layer w0.381: STEP_IN.1 41.2,4.76 40.13,3.69 26.54,3.69 25.53,4.71 STEP.4
M_STP: length 19.5
  Top Layer w0.381: STEP.5 28.07,5.22 28.7,4.58 38.23,4.58 40.37,6.72 42.07,6.72 42.45,6.34 STEP_IN.2
MCU_MOS: length 32.7
  Top Layer w0.508: v2(87.25,8.9) 95.63,17.28 95.63,20.96 94.88,21.71 R126.1 ; v2(93.22,7.5) 94.36,8.64 97.03,8.64 97.87,7.81 DRIVER.7
  Bottom Layer w0.508: v2(93.22,7.5) 88.65,7.5 v2(87.25,8.9)
MOS_G: length 10.3
  Top Layer w0.508: R29.2 86.57,32.3 D27.1 83.98,32.3 83.37,31.69 Q28.3
MOTOR_EN: length 62.2
  Top Layer w0.254: U1.13 48.74,27.16 arc(49.1,27.36) v1(49.5,27.43) ; v1(77.58,26.47) 77.08,26.47 arc(76.7,26.39) U6.13
  Top Layer w0.508: MOTOR.5 59.53,7.47 v2(59.56,7.5)
  信号层 w0.381: v1(49.5,27.43) 49.51,27.44 50.67,27.44 59.56,18.55 v2(59.56,7.5) 59.56,6.23 59.94,5.85 63.12,5.85 79.25,21.98 79.25,25.92 78.74,26.42 77.62,26.42 v1(77.58,26.47)
R_EN_IN: length 14.5
  Top Layer w0.381: 55.78,5.9 55.78,5.06 56.52,4.33 61.34,4.33 62.1,5.09 62.1,7.5 61.22,8.39 R6.2 61.03,9.63 U5.9
R_PH: length 26.1
  Top Layer w0.254: U6.15 v1(75.37,27.48)
  Top Layer w0.381: v2(61.47,10.68) 60.66,10.68 60.4,10.93 U5.11
  信号层 w0.381: v2(61.47,10.68) 61.47,13.58 v1(75.37,27.48)
R_PH_IN: length 8.6
  Top Layer w0.381: 58.28,5.9 58.28,11.3 58.56,11.58 U5.12 60.94,11.58 R5.2
R_PWM: length 29.4
  Top Layer w0.254: U6.14 75.87,26.47 arc(75.95,26.88) v1(76.19,27.23)
  Top Layer w0.381: U5.8 59.86,8.98 60.58,8.26 v2(60.58,7.63)
  信号层 w0.381: v1(76.19,27.23) 62.36,13.37 62.36,9.41 v2(60.58,7.63)
RA: length 20.5
  Top Layer w0.381: U6.23 v2(66.8,23.47)
  信号层 w0.381: v2(66.8,23.47) 62.41,27.87 v2(62.41,35.74)
  vias: v2(61.77,36.46) v2(61.77,35.74) v2(62.41,36.46) v2(68.71,43.08) v2(68.71,42.25) v2(68.71,41.42) v2(68.71,40.6) v2(69.54,43.08) v2(69.54,42.25) v2(69.54,41.42) v2(69.54,40.6) v2(70.38,43.08) v2(70.38,42.25) v2(70.38,41.42) v2(70.38,40.6) v2(71.22,43.08) v2(71.22,42.25) v2(71.22,41.42) v2(71.22,40.6)
RB: length 13.1
  Top Layer w0.381: U6.18 73.84,26.21 v2(73.84,28.71)
  信号层 w0.381: v2(73.84,28.71) 73.84,29.65 79.92,35.74 v2(80.88,35.74)
  vias: v2(75.06,43.08) v2(75.06,42.25) v2(75.06,41.42) v2(75.06,40.6) v2(75.89,43.08) v2(75.89,42.25) v2(75.89,41.42) v2(75.89,40.6) v2(76.73,43.08) v2(76.73,42.25) v2(76.73,41.42) v2(76.73,40.6) v2(77.57,43.08) v2(77.57,42.25) v2(77.57,41.42) v2(77.57,40.6) v2(80.87,36.46) v2(81.52,36.46) v2(81.52,35.74)
WATER1: length 23.1
  Top Layer w0.381: R105.1 99.64,22.93 D29.1
  Top Layer w0.508: DRIVER.1 90.37,9.48 99.04,18.16 D29.1
WATER2: length 13.2
  Top Layer w0.381: D30.1 99.51,9.68 R95.1
  Top Layer w0.508: DRIVER.2 91.62,7.81 93.34,9.53 98.72,9.53 D30.1
$1N1557: length 2.3
  Top Layer w0.254: LED1.2 57.92,26.9 arc(57.97,27.13) R28.1
$1N3488: length 5.3
  Top Layer w0.254: U1.12 v2(50.24,26.42) 50.73,26.42 arc(50.96,26.47) C13.1
  信号层 w0.254: v2(50.24,26.42) 50.24,24.73 arc(50.06,23.84) v2(49.55,23.07)
$1N3491: length 4.9
  Top Layer w0.254: C5.1 50.83,20.56 arc(50.75,20.98) 50.52,21.33 50.33,21.52 arc(49.83,21.85) 49.25,21.96 48.72,21.96 arc(48.38,22.03) 48.1,22.22 arc(47.81,22.66) 47.7,23.18 U1.4
$1N3492: length 3
  Top Layer w0.254: U1.1 46.2,20.74 arc(46.25,20.51) C11.2
$1N3493: length 3.9
  Top Layer w0.254: U1.3 47.2,22.55 arc(47.24,22.37) 47.34,22.22 49.11,20.45 arc(49.26,20.35) 49.43,20.31
$1N3501: length 5.1
  Top Layer w0.254: D7.1 arc(43.55,29.07) 44.32,29.22 R13.1 44.93,27.82 arc(45.08,27.06) U1.19
$1N3504: length 4.5
  Top Layer w0.254: U1.17 46.7,27.68 arc(46.87,28.51) R11.1 47.94,29.22 arc(48.72,29.07) D6.1
$1N3505: length 3.2
  Top Layer w0.254: U1.2 46.7,22.45 arc(46.77,22.12) 46.96,21.84 47.28,21.52 arc(47.65,20.96) 47.78,20.31
$1N3628: length 19.5
  Top Layer w0.254: R7.2 39.1,22.94 arc(38.91,22) D2.2
  Top Layer w0.508: R7.2 37.73,23.23 36.83,24.14 36.83,32.77 37.97,33.92 37.97,36.2 R9.2 38.1,36.33 Q1.4
$1N3632: length 6.7
  Top Layer w0.254: U1.24 42.77,23.92 arc(41.87,23.75) R7.1 41.1,22.33 arc(41.22,21.72) D2.1
$1N3744: length 6.8
  Top Layer w0.254: U1.22 42.84,24.92 arc(41.9,25.11) R8.1 41.1,26.56 arc(41.22,27.16) D5.1
$1N3746: length 16.4
  Top Layer w0.508: 44.5,38.28 44.5,36.33 R10.2 44.45,34.94 43.69,34.17 42.04,34.17 38.38,30.52 D5.2 39.1,26.96 R8.2
$1N4044: length 15
  Top Layer w0.254: R11.2 47.94,31.22 arc(48.72,31.37) D6.2
  Top Layer w0.508: Q3.4 57.29,36.34 R12.2 57.15,36.2 57.15,34.43 54.54,31.81 D6.2
$1N4182: length 13.9
  Top Layer w0.254: R13.2 44.32,31.22 arc(43.55,31.37) D7.2
  Top Layer w0.508: R13.2 44.93,32.11 46.48,33.66 50.16,33.66 50.83,34.33 R14.2 50.89,36.35 Q4.4
$1N5157: length 20.5
  Top Layer w0.254: R15.2 67.76,21.92 arc(67.57,20.98) D8.2
  Top Layer w0.508: R15.2 65.93,22.22 65.28,22.87 65.28,35.53 R17.2 65.58,35.83 Q5.4
$1N5160: length 5.8
  Top Layer w0.254: U6.24 71.56,22.97 arc(70.59,22.78) 69.77,22.23 R15.1 69.76,21.31 arc(69.88,20.7) D8.1
$1N5167: length 2.8
  Top Layer w0.254: U6.1 73.87,21.44 arc(73.68,20.49) C16.2
$1N5169: length 14.6
  Top Layer w0.254: 77.01,31.68 76.91,31.58 arc(76.09,31.03) 75.11,30.84 74.98,30.84
  Top Layer w0.508: Q7.4 84.63,35.84 R20.2 84.57,34.92 81.33,31.68 77.01,31.68
$1N5172: length 5
  Top Layer w0.254: U6.17 74.37,27.37 arc(74.53,28.16) 74.98,28.84 76.2,28.84 arc(76.64,28.75) 77.01,28.5
$1N5179: length 2.7
  Top Layer w0.254: U6.2 74.37,21.22 arc(74.53,20.42) C17.1
$1N5180: length 4.6
  Top Layer w0.254: C18.1 arc(78.12,19.7) 77.82,20.14 77.52,20.44 arc(77.24,20.63) 76.91,20.69 76.76,20.69 arc(76.52,20.74) 76.33,20.87 75.69,21.51 arc(75.59,21.62) 75.52,21.73 arc(75.47,21.8) 75.45,21.88 arc(75.39,22.07) U6.4
$1N5181: length 2.4
  Top Layer w0.254: U6.8 77.89,23.47 arc(78.65,23.63) C20.1
$1N5183: length 4.2
  Top Layer w0.254: U6.12 v1(78.04,25.47)
  信号层 w0.254: v1(78.04,25.47) 78.04,23.15 arc(77.95,22.7) v2(77.69,22.32)
$1N5184: length 3.8
  Top Layer w0.254: U6.3 74.87,21.77 arc(74.93,21.46) 75.11,21.2 76.6,19.71 arc(76.76,19.47) C18.2
$1N5185: length 5.6
  Top Layer w0.254: U6.19 73.17,27.69 arc(73.05,28.31) 72.69,28.84 71.79,28.84 arc(71.18,28.72) 70.66,28.37
$1N5192: length 14.2
  Top Layer w0.254: 72.69,30.84 72.4,30.84 arc(71.46,31.03) 70.66,31.56
  Top Layer w0.508: Q8.4 78.28,35.84 R22.2 78.22,34.16 77.34,33.28 73.66,33.28 72.69,32.32 72.69,30.84
$1N5224: length 5.8
  Top Layer w0.254: U6.22 71.3,23.97 arc(70.47,24.14) R16.1 69.77,25.27 arc(69.92,26.02) 70.35,26.66
$1N5237: length 16.8
  Top Layer w0.508: R16.2 67.77,26.06 D10.2 67.17,30.73 69.6,33.16 70.99,33.16 72.01,34.17 72.01,35.66 R18.2 71.93,35.83 Q6.4
$2N1901: length 6.6
  Top Layer w0.381: Q24.1 99.94,11.5 D30.2
$2N1907: length 6.5
  Top Layer w0.381: D29.2 99.64,24.93 R105.2 R104.2 105.23,24.93 Q23.1
$2N2685: length 18.8
  Bottom Layer w0.254: U57.2 85.59,20.08 arc(85.27,19.95) R25.2
  Bottom Layer w0.508: R25.2 81.4,19.63 R26.1
$2N2896: length 13.6
  Bottom Layer w0.254: 87.76,15.12 87.76,18.55 arc(88.02,19.17) 88.64,19.43 U57.1
  Bottom Layer w0.508: R26.2 82.29,14.1 83.19,14.99 87.67,14.99 R118.2 87.81,15.07 87.76,15.12
$2N3653: length 5.5
  Top Layer w0.508: Q29.1 89.63,29.83 R29.1 85.34,29.83 D27.2
$2N3846:
  vias: v2(90.76,37.66) v2(90.76,36.83) v2(90.76,36.01) v2(90.76,35.18) v2(91.59,37.66) v2(91.59,36.83) v2(91.59,36.01) v2(91.59,35.18) v2(92.43,37.66) v2(92.43,36.83) v2(92.43,36.01) v2(92.43,35.18) v2(93.27,37.66) v2(93.27,36.83) v2(93.27,36.01) v2(93.27,35.18)
$2N5962: length 4.8
  Top Layer w0.508: Q26.1 88.58,19.71 R128.2 R126.2
$2N6050: length 2.2
  Top Layer w0.508: Q26.3 84.1,20.7 R127.1
$2N6056: length 5.5
  Top Layer w0.508: R129.1 87.43,24.59 Q28.1 84.07,22.79 R127.2
$2N6342: length 6
  Bottom Layer w0.254: R130.2 R133.1 95.44,19.63 arc(95.31,19.69) 95.25,19.82 95.25,20.2 arc(95.09,20.58) 94.72,20.73 93.53,20.73
$2N6441: length 5.3
  Bottom Layer w0.254: 93.53,21.38 96.38,21.38 arc(96.51,21.44) R132.2 R131.2
$2N6447: length 8
  Bottom Layer w0.254: 93.53,20.08 94.35,20.08 arc(94.63,19.97) 94.74,19.69 94.74,18.04 arc(94.85,17.77) 95.12,17.66 96.54,17.66 arc(96.56,17.65) R133.2 arc(96.42,17.57) 96.36,17.42 R124.2
$3N810: length 2.3
  Top Layer w0.381: LED.2 31.37,39.49 R91.1
$3N1223: length 4.8
  Top Layer w0.381: Q22.4 22.57,43.23 R116.2 R117.1
$3N1227: length 11
  Top Layer w0.254: D24.2 24.51,38.49 23.37,39.63 20.49,39.63 20.23,39.89 Q21.4
  Top Layer w0.381: D24.2 26.03,37.65 R115.2 R114.2
$3N1392: length 5
  Top Layer w0.254: R113.2 28.67,33.68 U50.4 31.4,31.53 R112.1

## Copper pours and planes (outline as drawn; the poured copper is in the pictures)
+3.3V on Top Layer: 58.09,30.4 62.18,30.4 62.18,26.61 58.09,26.61
+3.3V on Top Layer: 33.29,19.59 27.22,19.59 27.22,16.9 33.29,16.9
+5V on Top Layer: 16.51,14.96 14.61,16.87 14.61,11.82 26.16,11.82 26.16,15.76 24.63,15.76 24.27,16.12 20.21,16.12 20.19,16.14 20.19,13.79 20,13.6 16.51,13.6
+5V on Top Layer: 3.45,17.41 3.45,6.87 10.41,6.87 10.41,12.91 11.77,14.27 16.6,14.27 16.64,14.23 16.64,19.15 17.02,19.53 17.02,25.92 14.48,25.92 14.48,18.68 13.21,17.41
+12V on Top Layer: 103.49,18.56 105.08,18.56 106.1,17.55 108.82,17.55 108.82,19.96 111.49,19.96 111.49,15.26 105.07,15.26 103.48,16.85 103.49,16.86
+12V on Top Layer: 108.84,6.49 113.66,6.49 113.66,15.25 109.47,15.25 108.94,15.79 108.94,19.82 115.7,19.82 115.7,1.79 108.84,1.79
+12V on Top Layer: 68.57,17.2 70.73,17.2 70.73,14.15 68.57,14.15
+12V on Top Layer: 4.57,33.16 8.25,33.16 8.76,32.65 8.76,31.63 10.16,30.23 19.3,30.23 19.46,30.39 21.18,30.39 22.1,29.47 24.27,29.47 24.27,28.58 19.81,28.58 18.54,27.31 4.57,27.31
+12V on Top Layer: 103.5,5.09 105.1,5.09 106.12,4.08 108.84,4.08 108.84,6.49 111.51,6.49 111.51,1.79 105.09,1.79 103.5,3.38 103.5,3.38
+12V on Top Layer: 56.64,48.02 56.64,52.84 59.06,52.84 59.18,52.97 59.18,45.73 60.45,44.46 65.66,44.46 65.79,44.59 65.91,44.46 65.91,40.01 53.09,40.01 53.09,44.46
+12V on Top Layer: 89.28,56.65 89.28,45.35 94.11,45.35 95.43,44.02 97.54,44.02 97.54,56.4 97.28,56.65
+12V on Top Layer: 80.52,39.98 80.52,46.15 85.31,50.94 91.31,50.94 91.31,45.61 86.07,45.61 84.92,44.46 84.92,40.01 80.56,40.01
+12V on Top Layer: 19.56,44 19.56,48.34 22.94,48.34 22.94,44
+12V on Bottom Layer: 19.69,48.4 19.69,38.49 16.51,35.31 -1.65,35.31 -1.65,27.06 -1.52,26.93 22.72,26.93 22.86,48.4
+12V on Bottom Layer: 21.76,40.44 21.76,33.11 21.97,32.9 28.59,32.9 32.02,29.47 60.57,29.47 60.57,39.25 61.26,39.94 65.88,39.94 65.88,45.11 63.47,47.52 59.16,47.52 59.16,53.24 59.06,53.35 57.02,53.35 56.77,53.09 56.77,48.4 53.09,44.71 53.09,39.89 57.15,39.89 57.4,40.14 57.4,33.91 32,33.91 30.75,35.16 30.75,41.27 29.97,42.05 28.37,40.44
+12V on Bottom Layer: 38.43,44.46 20.95,44.46 20.95,40.01 21.08,39.89 38.43,39.89
+12V on Bottom Layer: 59.16,33.52 59.32,33.63 59.52,33.66 84.33,33.66 84.46,33.54 84.46,36.76 84.42,36.95 84.31,37.11 81.56,39.86 81.39,39.98 81.2,40.01 80.9,40.01 80.54,40.16 80.39,40.52 80.39,46.41 80.43,46.6 80.54,46.77 84.81,51.04 84.98,51.15 85.17,51.19 97.41,51.19 97.54,51.06 97.54,44.63 97.39,44.27 97.03,44.12 88.14,44.12 87.78,43.97 87.63,43.61 87.63,30.23 87.48,29.88 87.12,29.73 59.06,29.73 58.7,29.88 58.55,30.23 58.55,32.69 58.59,32.89 58.7,33.05
+12V on Bottom Layer: 111.63,19.82 108.34,19.82 106.77,21.39 106.77,33.57 97.41,42.93 97.41,50.93 91.95,50.93 91.95,42.81 103.11,31.65 103.11,15.38 111.38,15.38 111.63,15.63
GND on Top Layer: 49.42,35.48 49.42,37.36 49.91,37.84 49.91,38.81 46.76,38.81 46.76,35.48
GND on Top Layer: 70.47,34.97 70.47,36.85 70.96,37.34 70.96,38.81 67.81,38.81 67.81,34.97
GND on Top Layer: 42.97,35.48 42.97,37.36 43.45,37.84 43.45,38.81 40.3,38.81 40.3,35.48
GND on Top Layer: 76.81,34.97 76.81,36.85 77.29,37.34 77.29,38.81 74.14,38.81 74.14,34.97
GND on Top Layer: -4.44,61.35 126.75,61.35 126.75,-4.94 -4.44,-4.94
GND on Bottom Layer: -3.94,60.84 119.51,60.84 119.51,-2.28 -3.94,-2.28
GND on 信号层: -4.32,61.48 121.16,61.48 121.16,-3.04 -4.32,-3.04
GND on GND: 0.26,54.74 117.74,54.74 117.74,0.26 0.26,0.26
I1 on Top Layer: 94.87,32.01 94.87,28.82 94.3,28.82 93.96,28.49 93.96,26.4 92.61,26.4 92.61,28.49 93.34,29.22 93.34,32.01
INPUT on Top Layer: 10.03,56.4 10.03,41.92 15.11,41.92 15.75,42.55 18.72,42.55 18.72,58.99 19.02,59.29 12.92,59.29
INPUT on Top Layer: 22.4,39.17 19.56,39.17 18.37,37.98 15.11,37.98 15.11,46.24 11.94,46.24 11.94,41.98 13.34,40.58 13.34,35.82 22.4,35.82
LA on Top Layer: 45.21,39.89 39.93,39.89 39.93,49.16 43.69,49.16 43.69,45.68 45.25,44.11 45.25,39.93
LA on Top Layer: 36.58,35.41 36.58,37.29 37.06,37.78 37.06,38.74 33.91,38.74 33.91,35.41
LA on Bottom Layer: 33.91,37.47 39.88,37.47 41.02,38.62 41.02,43.57 44.2,43.57 44.2,36.59 42.98,35.37 33.91,35.37
LB on Top Layer: 51.65,39.99 46.33,39.99 46.33,44.99 45.47,45.86 45.47,49.16 51.69,49.16 51.69,40.03
LB on Top Layer: 55.83,35.48 55.83,37.36 56.31,37.84 56.31,38.81 53.16,38.81 53.16,35.48
LB on Bottom Layer: 54.53,37.47 51.61,37.47 50.47,38.62 50.47,43.57 47.29,43.57 47.29,36.59 48.51,35.37 54.53,35.37
PWR_ON on Top Layer: 25.88,44.72 25.88,49.92 29.59,49.92 29.59,44.71 25.88,44.71
RA on Top Layer: 67.36,39.93 67.36,47.82 68.83,49.28 73.66,49.28 73.66,45.47 72.64,44.46 72.64,39.95 72.63,39.93
RA on Top Layer: 64.12,34.97 64.12,36.85 64.61,37.34 64.61,38.81 61.46,38.81 61.46,34.97
RA on Bottom Layer: 61.47,35.1 61.47,37.01 66.08,37.01 68.33,39.25 68.33,43.57 71.75,43.57 71.75,37.62 69.23,35.1
RB on Top Layer: 73.71,39.97 73.71,44.18 75.48,45.95 75.48,49.22 75.57,49.31 79.12,49.31 79.12,39.97
RB on Top Layer: 83.23,34.97 83.23,36.85 83.72,37.34 83.72,38.81 80.57,38.81 80.57,34.97
RB on Bottom Layer: 81.88,35.1 81.88,37.01 80.32,37.01 78.07,39.25 78.07,43.57 74.64,43.57 74.64,37.62 77.16,35.1
$1N3488 on Top Layer: 48.68,23.95 49.75,23.95 49.75,22.85 48.68,22.85
$1N3492 on Top Layer: 44.36,20.77 46.8,20.77 46.8,14.92 44.36,14.92
$1N5167 on Top Layer: 72.76,20.13 75.6,20.13 75.6,14.82 72.76,14.82
$1N5183 on Top Layer: 76.31,22.97 79.76,22.97 79.76,21.82 76.31,21.82
$2N1904 on Top Layer: 106.72,11.98 111.52,11.98 111.52,7.11 108.73,7.11 107.71,6.09 105.68,6.09 105.17,5.58 103.4,5.58 103.4,7.23 104.42,8.25 106.7,8.25 106.72,8.27
$2N1909 on Top Layer: 106.7,25.45 111.51,25.45 111.51,20.58 108.71,20.58 107.7,19.57 105.66,19.57 105.16,19.06 103.38,19.06 103.38,20.71 104.4,21.73 106.68,21.73 106.7,21.75
$2N3653 on Top Layer: 89.28,32.01 89.28,28.82 89.85,28.82 90.44,28.23 90.44,26.4 91.67,26.4 91.69,26.42 91.69,28.33 90.81,29.22 90.81,32.01
$2N3846 on Top Layer: 89.28,43.19 89.28,33.92 107.95,33.92 108.71,33.16 108.71,28.96 121.16,28.96 121.16,40.01 96.39,40.01 93.22,43.19
$2N3975 on Top Layer: 105.41,56.23 105.41,43.26 120.46,43.26 120.52,43.32 120.52,57.92 119.89,58.56 117.56,56.23
$3N725 on Top Layer: 25.42,28.08 25.42,19.57 20.45,19.57 20.45,28.08
$3N729 on Top Layer: 26.22,26.24 27.81,27.83 27.81,28.08 29.59,28.08 29.59,26.17 27.81,24.39 26.22,24.39
$3N1226 on Top Layer: 19.56,43.38 21.74,43.38 21.74,41.06 21.81,41.03 23.37,41.03 23.75,41.41 25.78,41.41 25.78,44.14 27.16,44.14 27.16,41.73 27.71,41.18 27.71,39.89 25.75,39.89 25.15,40.49 23.08,40.49 22.48,39.89 20.68,39.89 20.68,41.28 19.56,41.28 19.56,41.28

Small or netless copper shapes (teardrops, artwork), in the pictures only: 206 on Top Layer, 56 on Bottom Layer, 25 on 信号层, 52 on GND

## Text on the board
Bottom Silkscreen Layer: 采集
Top Silkscreen Layer: +5V | GND | +12V | NC | M_EN | M_STP | M_DIR | CAN_H | CAN_L | L_EN | R_EN | L_PH | R_PH | DLP2 | DLP1 | WA1 | WA2 | NTC | ADC_I | MOS | LA | RA | LB | RB | + | - | DC输入
